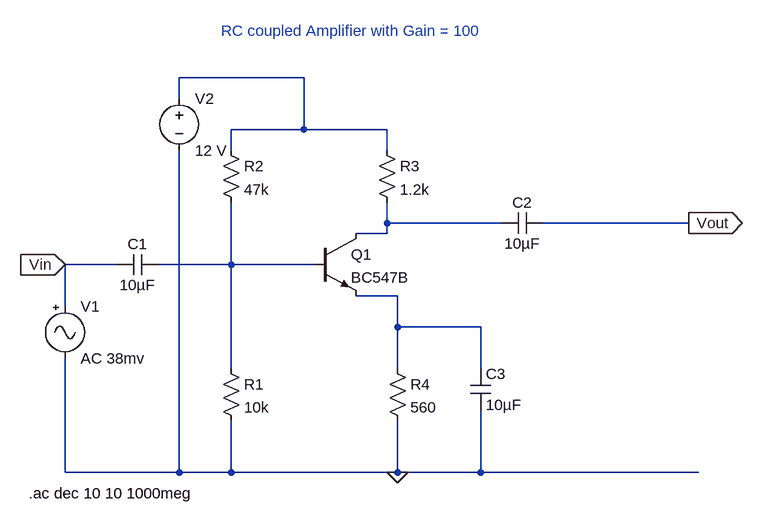
[diagram p0: schematic rcCoupleAmp.asc]
rcCoupleAmp.asc, the LTspice schematic file:
Version 4
SHEET 1 1056 680
WIRE 352 -256 160 -256
WIRE 160 -224 160 -256
WIRE 352 -176 352 -256
WIRE 352 -176 240 -176
WIRE 480 -176 352 -176
WIRE 240 -144 240 -176
WIRE 480 -144 480 -176
WIRE 480 -32 480 -64
WIRE 656 -32 480 -32
WIRE 944 -32 720 -32
WIRE 480 -16 480 -32
WIRE 480 -16 432 -16
WIRE 64 32 -16 32
WIRE 240 32 240 -64
WIRE 240 32 128 32
WIRE 368 32 240 32
WIRE 496 80 432 80
WIRE -16 96 -16 32
WIRE 496 128 496 80
WIRE 624 128 496 128
WIRE 240 192 240 32
WIRE 496 192 496 128
WIRE 624 192 624 128
WIRE -16 352 -16 176
WIRE 160 352 160 -144
WIRE 160 352 -16 352
WIRE 240 352 240 272
WIRE 240 352 160 352
WIRE 496 352 496 272
WIRE 496 352 240 352
WIRE 624 352 624 256
WIRE 624 352 496 352
WIRE 960 352 624 352
FLAG 496 352 0
FLAG -16 32 Vin
IOPIN -16 32 In
FLAG 944 -32 Vout
IOPIN 944 -32 Out
SYMBOL Misc\\signal -16 80 R0
WINDOW 123 0 0 Left 0
WINDOW 39 0 0 Left 0
SYMATTR InstName V1
SYMATTR Value AC 38mv
SYMBOL npn 368 -16 R0
SYMATTR InstName Q1
SYMATTR Value BC547B
SYMBOL res 224 -160 R0
SYMATTR InstName R2
SYMATTR Value 47k
SYMBOL res 224 176 R0
SYMATTR InstName R1
SYMATTR Value 10k
SYMBOL res 464 -160 R0
SYMATTR InstName R3
SYMATTR Value 1.2k
SYMBOL res 480 176 R0
SYMATTR InstName R4
SYMATTR Value 560
SYMBOL cap 608 192 R0
SYMATTR InstName C3
SYMATTR Value 10µF
SYMBOL cap 128 16 R90
WINDOW 0 0 32 VBottom 2
WINDOW 3 32 32 VTop 2
SYMATTR InstName C1
SYMATTR Value 10µF
SYMBOL cap 720 -48 R90
WINDOW 0 0 32 VBottom 2
WINDOW 3 32 32 VTop 2
SYMATTR InstName C2
SYMATTR Value 10µF
SYMBOL voltage 160 -240 R0
SYMATTR InstName V2
SYMATTR Value 12 V
TEXT -72 384 Left 2 !.ac dec 10 10 1000meg
TEXT 224 -328 Left 2 ;RC coupled Amplifier with Gain = 100

The netlist it stands for:
* rcCoupleAmp.asc
V1 Vin 0 AC 38mv
Q1 N002 N003 N004 0 BC547B
R2 N001 N003 47k
R1 N003 0 10k
R3 N001 N002 1.2k
R4 N004 0 560
C3 N004 0 10µF
C1 N003 Vin 10µF
C2 Vout N002 10µF
V2 N001 0 12 V
.model NPN NPN
.model PNP PNP
.lib standard.bjt
.ac dec 10 10 1000meg
* RC coupled Amplifier with Gain = 100
.backanno
.end